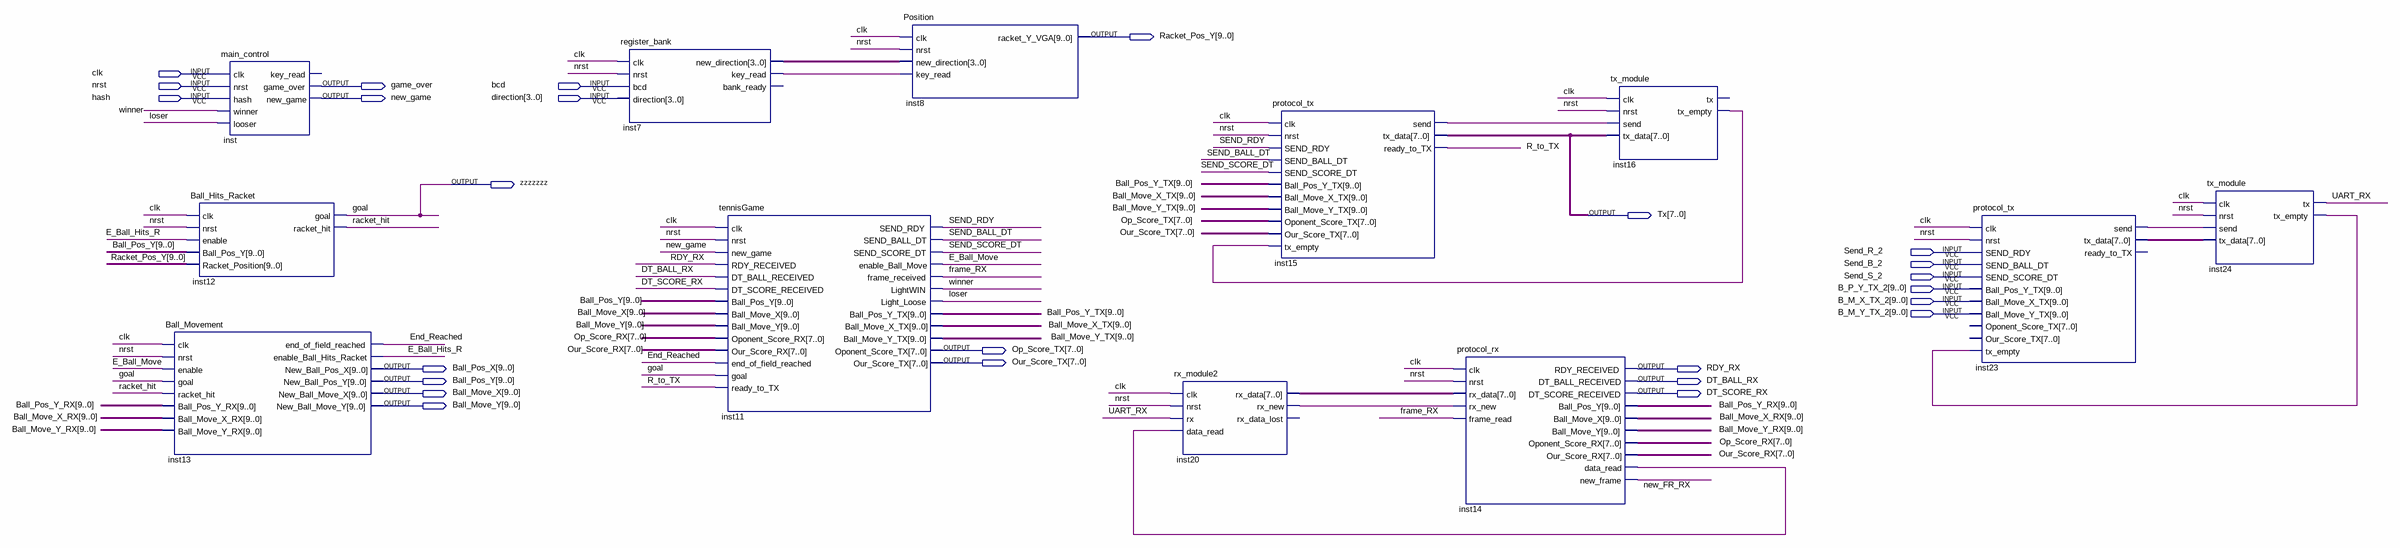
[diagram p0: schematic sheet]
// Quartus schematic Game_P2_Demo.bdf as structural Verilog: 12 symbols, 25 pins
module Game_P2_Demo (
  input  clk,
  input  nrst,
  input  bcd,
  input  hash,
  input  [3:0] direction,
  input  Send_R_2,
  input  Send_B_2,
  input  Send_S_2,
  input  [9:0] B_P_Y_TX_2,
  input  [9:0] B_M_X_TX_2,
  input  [9:0] B_M_Y_TX_2,
  output [9:0] Racket_Pos_Y,
  output game_over,
  output new_game,
  output zzzzzzz,
  output [7:0] Tx,
  output [7:0] Op_Score_TX,
  output [7:0] Our_Score_TX,
  output [9:0] Ball_Pos_X,
  output RDY_RX,
  output [9:0] Ball_Pos_Y,
  output DT_BALL_RX,
  output [9:0] Ball_Move_X,
  output DT_SCORE_RX,
  output [9:0] Ball_Move_Y
);

  wire E_Ball_Hits_R, E_Ball_Move, End_Reached, frame_RX, inst7_key_read, inst14_data_read, inst15_send,
       inst16_tx_empty, inst20_rx_new, inst23_send, inst24_tx_empty, loser, new_FR_RX, R_to_TX, racket_hit,
       SEND_BALL_DT, SEND_RDY, SEND_SCORE_DT, UART_RX, winner;
  wire [3:0] inst7_new_direction;
  wire [7:0] inst20_rx_data, inst23_tx_data, Op_Score_RX, Our_Score_RX;
  wire [9:0] Ball_Move_X_RX, Ball_Move_X_TX, Ball_Move_Y_RX, Ball_Move_Y_TX, Ball_Pos_Y_RX, Ball_Pos_Y_TX;

  Ball_Hits_Racket inst12 (
    .clk(clk), .nrst(nrst), .enable(E_Ball_Hits_R), .Ball_Pos_Y(Ball_Pos_Y), .Racket_Position(Racket_Pos_Y),
    .goal(zzzzzzz), .racket_hit(racket_hit));
  Ball_Movement inst13 (
    .clk(clk), .nrst(nrst), .enable(E_Ball_Move), .goal(zzzzzzz), .racket_hit(racket_hit),
    .Ball_Pos_Y_RX(Ball_Pos_Y_RX), .Ball_Move_X_RX(Ball_Move_X_RX), .Ball_Move_Y_RX(Ball_Move_Y_RX),
    .end_of_field_reached(End_Reached), .enable_Ball_Hits_Racket(E_Ball_Hits_R), .New_Ball_Pos_X(Ball_Pos_X),
    .New_Ball_Pos_Y(Ball_Pos_Y), .New_Ball_Move_X(Ball_Move_X), .New_Ball_Move_Y(Ball_Move_Y));
  main_control inst (
    .clk(clk), .nrst(nrst), .hash(hash), .winner(winner), .looser(loser), .game_over(game_over),
    .new_game(new_game));  // open: key_read
  register_bank inst7 (
    .clk(clk), .nrst(nrst), .bcd(bcd), .direction(direction), .new_direction(inst7_new_direction),
    .key_read(inst7_key_read));  // open: bank_ready
  tennisGame inst11 (
    .clk(clk), .nrst(nrst), .new_game(new_game), .RDY_RECEIVED(RDY_RX), .DT_BALL_RECEIVED(DT_BALL_RX),
    .DT_SCORE_RECEIVED(DT_SCORE_RX), .Ball_Pos_Y(Ball_Pos_Y), .Ball_Move_X(Ball_Move_X),
    .Ball_Move_Y(Ball_Move_Y), .Oponent_Score_RX(Op_Score_RX), .Our_Score_RX(Our_Score_RX),
    .end_of_field_reached(End_Reached), .goal(zzzzzzz), .ready_to_TX(R_to_TX), .SEND_RDY(SEND_RDY),
    .SEND_BALL_DT(SEND_BALL_DT), .SEND_SCORE_DT(SEND_SCORE_DT), .enable_Ball_Move(E_Ball_Move),
    .frame_received(frame_RX), .LightWIN(winner), .Light_Loose(loser), .Ball_Pos_Y_TX(Ball_Pos_Y_TX),
    .Ball_Move_X_TX(Ball_Move_X_TX), .Ball_Move_Y_TX(Ball_Move_Y_TX), .Oponent_Score_TX(Op_Score_TX),
    .Our_Score_TX(Our_Score_TX));
  Position inst8 (
    .clk(clk), .nrst(nrst), .new_direction(inst7_new_direction), .key_read(inst7_key_read),
    .racket_Y_VGA(Racket_Pos_Y));
  rx_module2 inst20 (
    .clk(clk), .nrst(nrst), .rx(UART_RX), .data_read(inst14_data_read), .rx_data(inst20_rx_data),
    .rx_new(inst20_rx_new));  // open: rx_data_lost
  protocol_tx inst15 (
    .clk(clk), .nrst(nrst), .SEND_RDY(SEND_RDY), .SEND_BALL_DT(SEND_BALL_DT), .SEND_SCORE_DT(SEND_SCORE_DT),
    .Ball_Pos_Y_TX(Ball_Pos_Y_TX), .Ball_Move_X_TX(Ball_Move_X_TX), .Ball_Move_Y_TX(Ball_Move_Y_TX),
    .Oponent_Score_TX(Op_Score_TX), .Our_Score_TX(Our_Score_TX), .tx_empty(inst16_tx_empty),
    .send(inst15_send), .tx_data(Tx), .ready_to_TX(R_to_TX));
  protocol_rx inst14 (
    .clk(clk), .nrst(nrst), .rx_data(inst20_rx_data), .rx_new(inst20_rx_new), .frame_read(frame_RX),
    .RDY_RECEIVED(RDY_RX), .DT_BALL_RECEIVED(DT_BALL_RX), .DT_SCORE_RECEIVED(DT_SCORE_RX),
    .Ball_Pos_Y(Ball_Pos_Y_RX), .Ball_Move_X(Ball_Move_X_RX), .Ball_Move_Y(Ball_Move_Y_RX),
    .Oponent_Score_RX(Op_Score_RX), .Our_Score_RX(Our_Score_RX), .data_read(inst14_data_read),
    .new_frame(new_FR_RX));
  tx_module inst16 (.clk(clk), .nrst(nrst), .send(inst15_send), .tx_data(Tx), .tx_empty(inst16_tx_empty));  // open: tx
  protocol_tx inst23 (
    .clk(clk), .nrst(nrst), .SEND_RDY(Send_R_2), .SEND_BALL_DT(Send_B_2), .SEND_SCORE_DT(Send_S_2),
    .Ball_Pos_Y_TX(B_P_Y_TX_2), .Ball_Move_X_TX(B_M_X_TX_2), .Ball_Move_Y_TX(B_M_Y_TX_2),
    .tx_empty(inst24_tx_empty), .send(inst23_send), .tx_data(inst23_tx_data));  // open: Oponent_Score_TX, Our_Score_TX, ready_to_TX
  tx_module inst24 (
    .clk(clk), .nrst(nrst), .send(inst23_send), .tx_data(inst23_tx_data), .tx(UART_RX),
    .tx_empty(inst24_tx_empty));

  // Other names for the same wires on the sheet: goal = zzzzzzz
endmodule
